# Altium schematic sheet Arduino-RedBoard.SchDoc: Arduino UNO (VN)
size A4; Author: Tran Tuan; CompanyName: Vnelektronics Co.,Ltd; Organization: Vnelektronics Co.,Ltd; Address1: 776 Ton Duc Thang; Address2: Lien Chieu, Da Nang; Revision: 1.0; SheetNumber: 01; SheetTotal: 01
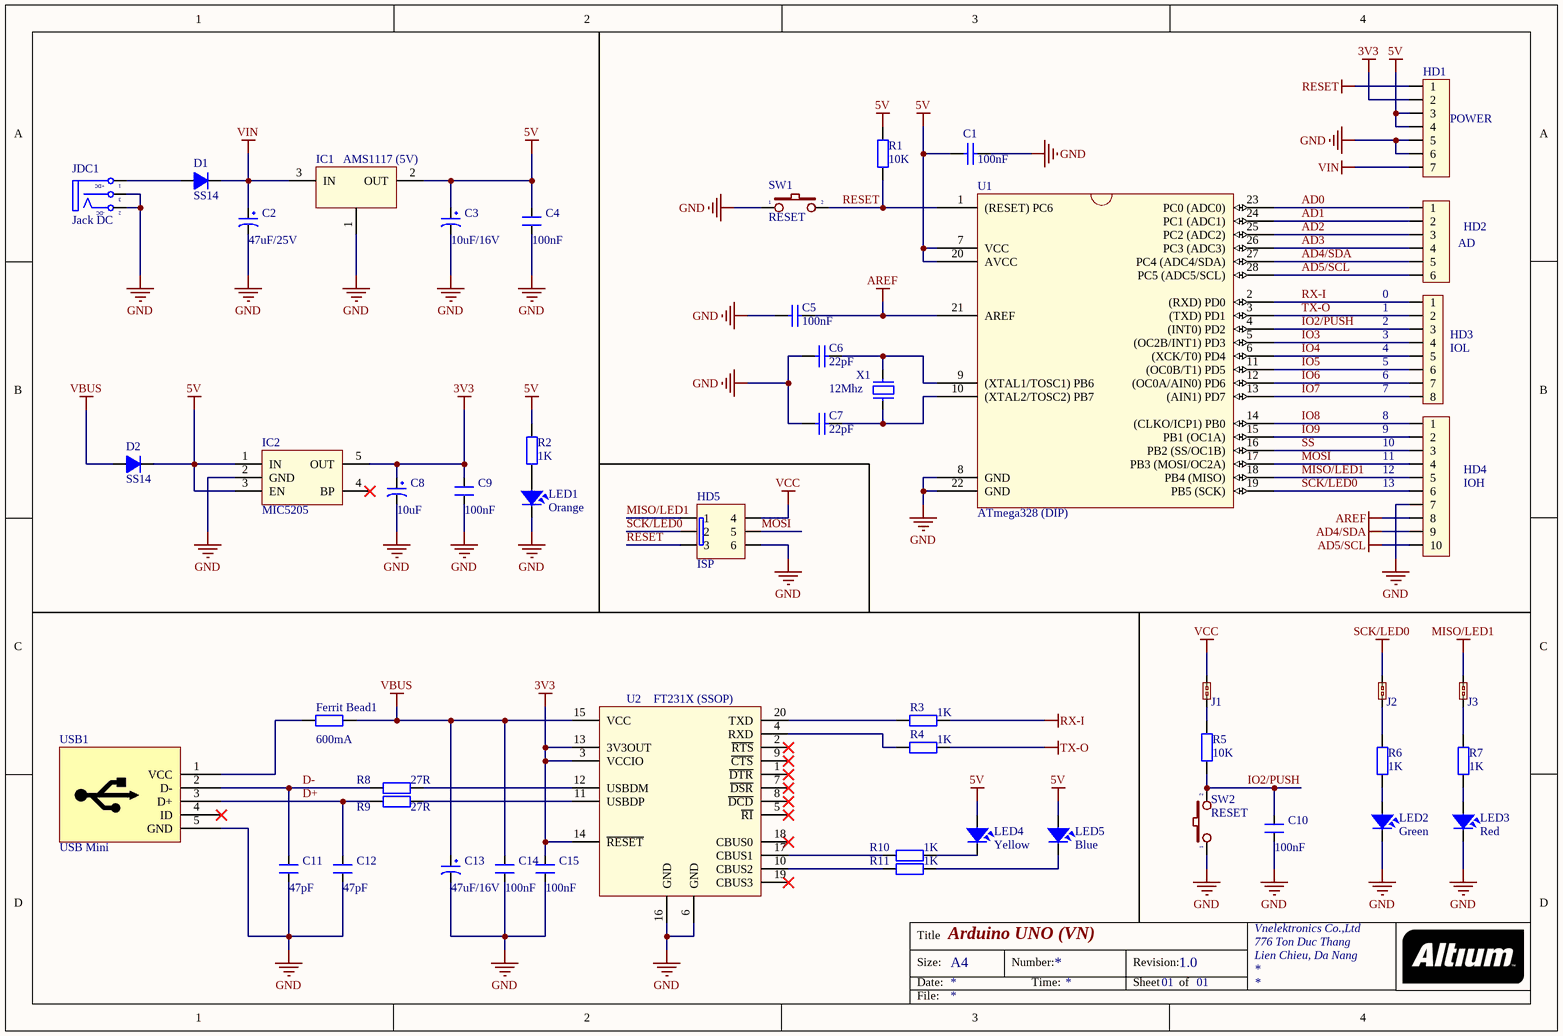
[diagram p0: Arduino-RedBoard.SchDoc]

## Parts
C1  value 100nF  [C0603]  (hidden comment: 5AK102KABAA)
C2  47uF/25V  [C_FK_47UF_25V]
C3  10uF/16V  [C0805]
C4  100nF  [C0603]
C5  value 100nF  [C0603]  (hidden comment: 5AK102KABAA)
C6  value 22pF  [C0603]  (hidden comment: 5AK102KABAA)
C7  value 22pF  [C0603]  (hidden comment: 5AK102KABAA)
C8  10uF  [C0805]
C9  100nF  [C0603]
C10  100nF  [C0603]
C11  47pF  [C0805]
C12  47pF  [C0805]
C13  47uF/16V  [C_FK_47UF_16V]
C14  100nF  [C0603]
C15  100nF  [C0603]
D1  SS14  [SS14]
D2  SS14  [SS14]
Ferrit_Bead1  600mA  [CB2012]
HD1  POWER  [Header_7]
HD2  AD  [Header_6]
HD3  IOL  [Header_8]
HD4  IOH  [Header_10]
HD5  ISP  [Header_3x2]
IC1  AMS1117 (5V)  [AMS1117-5.0V]
IC2  MIC5205  [MIC5205]
J1  Short Jump  [Header_2]  (value not drawn)
J2  Short Jump  [Header_2]  (value not drawn)
J3  Short Jump  [Header_2]  (value not drawn)
JDC1  Jack DC  [DC-IN]
LED1  Orange  [Led 0805Y]
LED2  Green  [Led 0805G]
LED3  Red  [Led 0805R]
LED4  Yellow  [Led 0805Y]
LED5  Blue  [Led 0805BL]
R1  value 10K  [RESC2012L]  (hidden comment: Res2)
R2  value 1K  [RESC2012L]  (hidden comment: Res2)
R3  value 1K  [RESC2012L]  (hidden comment: Res2)
R4  value 1K  [RESC2012L]  (hidden comment: Res2)
R5  value 10K  [RESC2012L]  (hidden comment: Res2)
R6  value 1K  [RESC2012L]  (hidden comment: Res2)
R7  value 1K  [RESC2012L]  (hidden comment: Res2)
R8  value 27R  [RESC2012L]  (hidden comment: Res2)
R9  value 27R  [RESC2012L]  (hidden comment: Res2)
R10  value 1K  [RESC2012L]  (hidden comment: Res2)
R11  value 1K  [RESC2012L]  (hidden comment: Res2)
SW1  RESET  [BUTTON 2PIN TRON]
SW2  RESET  [BUTTON 2PIN TRON]
U1  ATmega328 (DIP)  [ATmega328 (DIP)]
U2  FT231X (SSOP)  [SSOP 20]
USB1  USB Mini  [USBMNIB]
X1  12Mhz  [CRYSTAL]

## Nets
3V3: C8.1 C9.2 C15.2 HD1.2 IC2.5(OUT) U2.3(VCCIO) U2.13(3V3OUT) U2.14(~{RESET})
5V: C1.2 C3.1 C4.2 D2.2(K) HD1.3 HD1.4 IC1.2(OUT) IC2.1(IN) IC2.3(EN) LED4.1 LED5.1 R1.2 R2.2 U1.7(VCC) U1.20(AVCC)
AD4/SDA: HD2.5 HD4.9 U1.27(PC4_(ADC4/SDA))
AD5/SCL: HD2.6 HD4.10 U1.28(PC5_(ADC5/SCL))
AREF: C5.2 HD4.8 U1.21(AREF)
GND: C1.1 C2.2 C3.2 C4.1 C5.1 C6.1 C7.1 C8.2 C9.1 C10.1 C11.1 C12.1 C13.2 C14.2 C15.1 HD1.5 HD1.6 HD4.7 HD5.6 IC1.1(GND) IC2.2(GND) JDC1.2(TN) JDC1.3(S) LED1.2 LED2.2 LED3.2 SW1.1 SW2.1 U1.8(GND) U1.22(GND) U2.6(GND) U2.16(GND) USB1.5(GND)
MISO/LED1: HD4.5 HD5.1 J3.2 U1.18(PB4_(MISO))
RESET: HD1.1 HD5.3 R1.1 SW1.2 U1.1((RESET)_PC6)
RX-I: HD3.1 R3.2 U1.2((RXD)_PD0)
SCK/LED0: HD4.6 HD5.2 J2.2 U1.19(PB5_(SCK))
TX-O: HD3.2 R4.2 U1.3((TXD)_PD1)
VBUS: C13.1 C14.1 D2.1(A) Ferrit_Bead1.2 U2.15(VCC)
VCC: HD5.4 J1.2
VIN: C2.1 D1.2(K) HD1.7 IC1.3(IN)
AD0: HD2.1 U1.23(PC0_(ADC0))
AD1: HD2.2 U1.24(PC1_(ADC1))
AD2: HD2.3 U1.25(PC2_(ADC2))
AD3: HD2.4 U1.26(PC3_(ADC3))
D+: C12.2 R9.2 USB1.3(D+)
D-: C11.2 R8.2 USB1.2(D-)
IO2/PUSH: C10.2 HD3.3 R5.1 SW2.2 U1.4((INT0)_PD2)
IO3: HD3.4 U1.5((OC2B/INT1)_PD3)
IO4: HD3.5 U1.6((XCK/T0)_PD4)
IO5: HD3.6 U1.11((OC0B/T1)_PD5)
IO6: HD3.7 U1.12((OC0A/AIN0)_PD6)
IO7: HD3.8 U1.13((AIN1)_PD7)
IO8: HD4.1 U1.14((CLKO/ICP1)_PB0)
IO9: HD4.2 U1.15(PB1_(OC1A))
MOSI: HD4.4 HD5.5 U1.17(PB3_(MOSI/OC2A))
SS: HD4.3 U1.16(PB2_(SS/OC1B))
NetC6_2: C6.2 U1.9((XTAL1/TOSC1)_PB6) X1.2
NetC7_2: C7.2 U1.10((XTAL2/TOSC2)_PB7) X1.1
NetD1_1: D1.1(A) JDC1.1(T)
NetFerrit_Bead1_1: Ferrit_Bead1.1 USB1.1(VCC)
NetJ1_1: J1.1 R5.2
NetJ2_1: J2.1 R6.2
NetJ3_1: J3.1 R7.2
NetLED1_1: LED1.1 R2.1
NetLED2_1: LED2.1 R6.1
NetLED3_1: LED3.1 R7.1
NetLED4_2: LED4.2 R10.1
NetLED5_2: LED5.2 R11.1
NetR3_1: R3.1 U2.20(TXD)
NetR4_1: R4.1 U2.4(RXD)
NetR8_1: R8.1 U2.12(USBDM)
NetR9_1: R9.1 U2.11(USBDP)
NetR10_2: R10.2 U2.17(CBUS1)
NetR11_2: R11.2 U2.10(CBUS2)

Not connected (* = marked no-connect by the designer): IC2 4(BP)*; U2 1(~{DTR})* 2(~{RTS})* 5(~{RI})* 7(~{DSR})* 8(~{DCD})* 9(~{CTS})* 18(CBUS0)* 19(CBUS3)*; USB1 4(ID)*

## Notes on the sheet
- 0
- 1
- 2
- (near HD3) 3
- (near HD3) 4
- (near HD3) 5
- 6
- 7
- 8
- 9
- (near HD4) 10
- (near HD4) 11
- (near HD4) 12
- (near HD4) 13
- Title
- Size:
- Date:
- A4
- Number:
- Time:
- Revision:
- Sheet
- of
- File:
- (in symbol DCIN) +DC; -DC

## Library data of the parts
C1 C5-C7 = 5AK102KABAA: CAP NPO CAPNTO 1nF 100V 10%; ComponentLink1Description: Datasheet; ComponentLink1URL: D:\Dropbox\Datasheets\Passive Components\Capacitors\AVX Disc Ceramic Capacitors.pdf; Unit Price: 0.003
C2 C13 = CP1
  C2: Supplier: http://banlinhkien.vn/goods-2216-tu-nhom-47uf-25v-6-3x5-5mm.html#.U9cKbkBbjIU
  C13: Supplier: http://thegioiic.com/products/eee-1ca470sp
C3 C8 = CP1: Cap P  0,1uF < 22uF , 16 - 50V; Value: 10uF/50V; Description 1: 10 => 220uF/6,3V/10V - 10uF => 100uF/16V; Description 2: 0,1uF => 33uF/50V - 10uF => 22uF/63V; Description 3: 0,47uF => 10uF/100V
C4 C9-C12 C14 C15 = CN2: Cap np 104 => 105pF; Value: 0.1uF
D1 D2 = D1A: Diode 1A; Value: 1N4007
Ferrit_Bead1 = Res2: Ferrit Bead; Supplier: http://tme.vn/Product.aspx?id=733#page=pro_info
HD1 = Hed7: Header 7; Value: Header 5
HD2 = Hed6: Header 6; Value: Header 5
HD3 = Hed8: Hedear 8; Creat by: VanDungEvn@Gmail.com
HD4 = Hed10: Header 10; Value: Header 5
HD5 = HED3x2: Header 3x2; Value: Header 3x2
IC1 = AMS1117: 1A LOW DROPOUT VOLTAGE REGULATOR
IC2 = MIC5205: 150mA Low  -  Noise LDO Regulator; Supplier: http://thegioiic.com/products/mic5205-3-3bm5
J1-J3 = ShortJump
JDC1 = DCIN: Jac DC input; Value: Jac DC
LED1-LED5 = LED: LED Single colour Green and Red; Value: LED 3 ly Single Colour
R1-R11 = Res2: Resistor; Published: 8-Jun-2000; LatestRevisionDate: 17-Jul-2002; LatestRevisionNote: Re-released for DXP Platform.; PackageReference: AXIAL-0.4; Publisher: Altium Limited; PackageDescription: Axial Device, Thru-Hole; 2 Leads; 0.4 in Pin Spacing
SW1 SW2 = SW2: Switch button 2 pin; Value: SW chip 2 pin
U1 = ATmega328_1: Atmel 8-bit Microcontroller
U2 = FT231X: FT231Z (SSOP) - USB to UART; Supplier: http://www.futureelectronics.com/en/technologies/semiconductors/signal-interface/usb/Pages/5019074-FT231XS-U.aspx?IM=0; Package: SSOP-20
USB1 = USB_M
X1 = XT2: Crystal For all Crystal 2pin.; Value: 4Mhz